# EAGLE schematic fabTinyStar-013 (EAGLE 6.5.0)
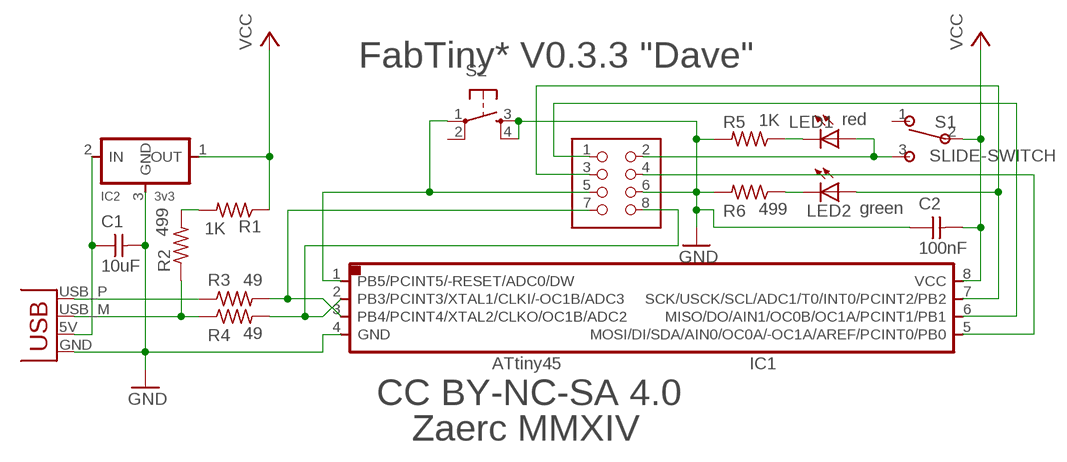
[diagram p0: schematic, sheet 1]

## Parts
C1  10uF  UNPOLARIZED_CAPACITOR1206  [1206]
C2  100nF  UNPOLARIZED_CAPACITOR1206  [1206]
IC1  ATTINY*5  ATTINY45SI  [SOIC8]
IC2  3v3  REGULATORSOT23  [SOT23]
JP1  PINHD-2X04  [54202-G0808LF]
LED1  red  LEDSMT1206  [1206]
LED2  green  LEDSMT1206  [1206]
R1  1K  RESISTOR1206  [1206]
R2  499  RESISTOR1206  [1206]
R3  49  RESISTOR1206  [1206]
R4  49  RESISTOR1206  [1206]
R5  1K  RESISTOR1206  [1206]
R6  499  RESISTOR1206  [1206]
S1  SLIDE-SWITCH  [AYZ0102AGRLC]
S2  6MM_SWITCH6MM_SWITCH  [6MM_SWITCH]
USB  USBPCB  [USB-A-PCB]

## Nets
5V: C1.1 IC2.2(IN) USB.5V(VBUS)
B3: IC1.2(PB3/PCINT3/XTAL1/CLKI/-OC1B/ADC3) JP1.8 R4.2
B4: IC1.3(PB4/PCINT4/XTAL2/CLKO/OC1B/ADC2) JP1.7 R3.2
D+: R3.1 USB.USB_P(D+)
D-: R2.1 R4.1 USB.USB_M(D-)
GND: C1.2 C2.1 IC1.4(GND) IC2.3(GND) JP1.6 R5.2 R6.2 S2.3(S) S2.4(S1) USB.GND
MISO: IC1.6(MISO/DO/AIN1/OC0B/OC1A/PCINT1/PB1) JP1.1
MOSI: IC1.5(MOSI/DI/SDA/AIN0/OC0A/-OC1A/AREF/PCINT0/PB0) JP1.4
N$1: R1.2 R2.2
N$13: LED2.C R6.1
N$14: LED1.C R5.1
RESET: IC1.1(PB5/PCINT5/-RESET/ADC0/DW) JP1.5 S2.1(P)
SCK: IC1.7(SCK/USCK/SCL/ADC1/T0/INT0/PCINT2/PB2) JP1.3 LED2.A
TP: JP1.2 LED1.A S1.3
VCC: C2.2 IC1.8(VCC) IC2.1(OUT) R1.1 S1.2
Unconnected: S1.1 S2.2(P1)

## Notes on the sheet
- FabTiny* V0.3.3 "Dave"
- CC BY-NC-SA 4.0
- Zaerc MMXIV

## Library data of the parts
C1 C2 = 01_FAB_Hello:UNPOLARIZED_CAPACITOR: unpolarized_capacitor
IC1 = 01_fab:ATTINY45
IC2 = 01_fab:REGULATOR
JP1 = Zaerc:PINHD-2X04
LED1 LED2 = led:LED: LED OSRAM: - CHIPLED LG R971, LG N971, LY N971, LG Q971, LY Q971, LO R971, LY R971 LH N974, LH R974 LS Q976, LO Q976, LY Q976 LO Q996 - Hyper CHIPLED LW Q18S LB Q993, LB Q99A, LB R99A - SideLED LS A670, LO A670, LY A670, LG A670, LP A670 LB A673, LV A673, LT A673, LW A673 LH A674 LY A675 LS A676, LA A676, LO A676, LY A676, LW A676 LS A679, LY A679, LG A679 - Hyper Micro SIDELED® LS Y876, LA Y876, LO Y876, LY Y876 LT Y87S - SmartLED LW L88C, LW L88S LB L89C, LB L89S, LG L890 LS L89K, LO L89K, LY L89K LS L896, LA L896, LO L896, LY L896 - TOPLED LS T670, LO T670, LY T670, LG T670, LP T670 LSG T670, LSP T670, LSY T670, LOP T670, LYG T670 LG T671, LOG T671, LSG T671 LB T673, LV T673, LT T673, LW T673 LH T674 LS T676, LA T676, LO T676, LY T676, LB T676, LH T676, LSB T676, LW T676 LB T67C, LV T67C, LT T67C, LS T67K, LO T67K, LY T67K, LW E67C LS E67B, LA E67B, LO E67B, LY E67B, LB E67C, LV E67C, LT E67C LW T67C LS T679, LY T679, LG T679 LS T770, LO T770, LY T770, LG T770, LP T770 LB T773, LV T773, LT T773, LW T773 LH T774 LS E675, LA E675, LY E675, LS T675 LS T776, LA T776, LO T776, LY T776, LB T776 LHGB T686 LT T68C, LB T68C - Hyper Mini TOPLED® LB M676 - Mini TOPLED Santana® LG M470 LS M47K, LO M47K, LY M47K Source: http://www.osram.convergy.de LUXEON: - LUMILED® LXK2-PW12-R00, LXK2-PW12-S00, LXK2-PW14-U00, LXK2-PW14-V00 LXK2-PM12-R00, LXK2-PM12-S00, LXK2-PM14-U00 LXK2-PE12-Q00, LXK2-PE12-R00, LXK2-PE12-S00, LXK2-PE14-T00, LXK2-PE14-U00 LXK2-PB12-K00, LXK2-PB12-L00, LXK2-PB12-M00, LXK2-PB14-N00, LXK2-PB14-P00, LXK2-PB14-Q00 LXK2-PR12-L00, LXK2-PR12-M00, LXK2-PR14-Q00, LXK2-PR14-R00 LXK2-PD12-Q00, LXK2-PD12-R00, LXK2-PD12-S00 LXK2-PH12-R00, LXK2-PH12-S00 LXK2-PL12-P00, LXK2-PL12-Q00, LXK2-PL12-R00 Source: www.luxeon.com KINGBRIGHT: KA-3528ASYC Source: www.kingbright.com
R1-R6 = 01_FAB_Hello:RESISTOR
S1 = Zaerc:SLIDE-SWITCH
S2 = 01_fab:6MM_SWITCH: OMRON SWITCH
USB = SparkFun:USB: USB Connectors USB-B-PTH is fully proven SKU : PRT-00139 USB-miniB is fully proven SKU : PRT-00587 USB-A-PCB is untested. USB-A-H is throughly reviewed, but untested. Spark Fun Electronics SKU : PRT-00437 USB-B-SMT is throughly reviewed, but untested. Needs silkscreen touching up. USB-A-S has not been used/tested USB-MB-H has not been used/tested